# Altium schematic sheet Diode - Zener.SchDoc
size A3; SheetNumber: 20; SheetTotal: 20
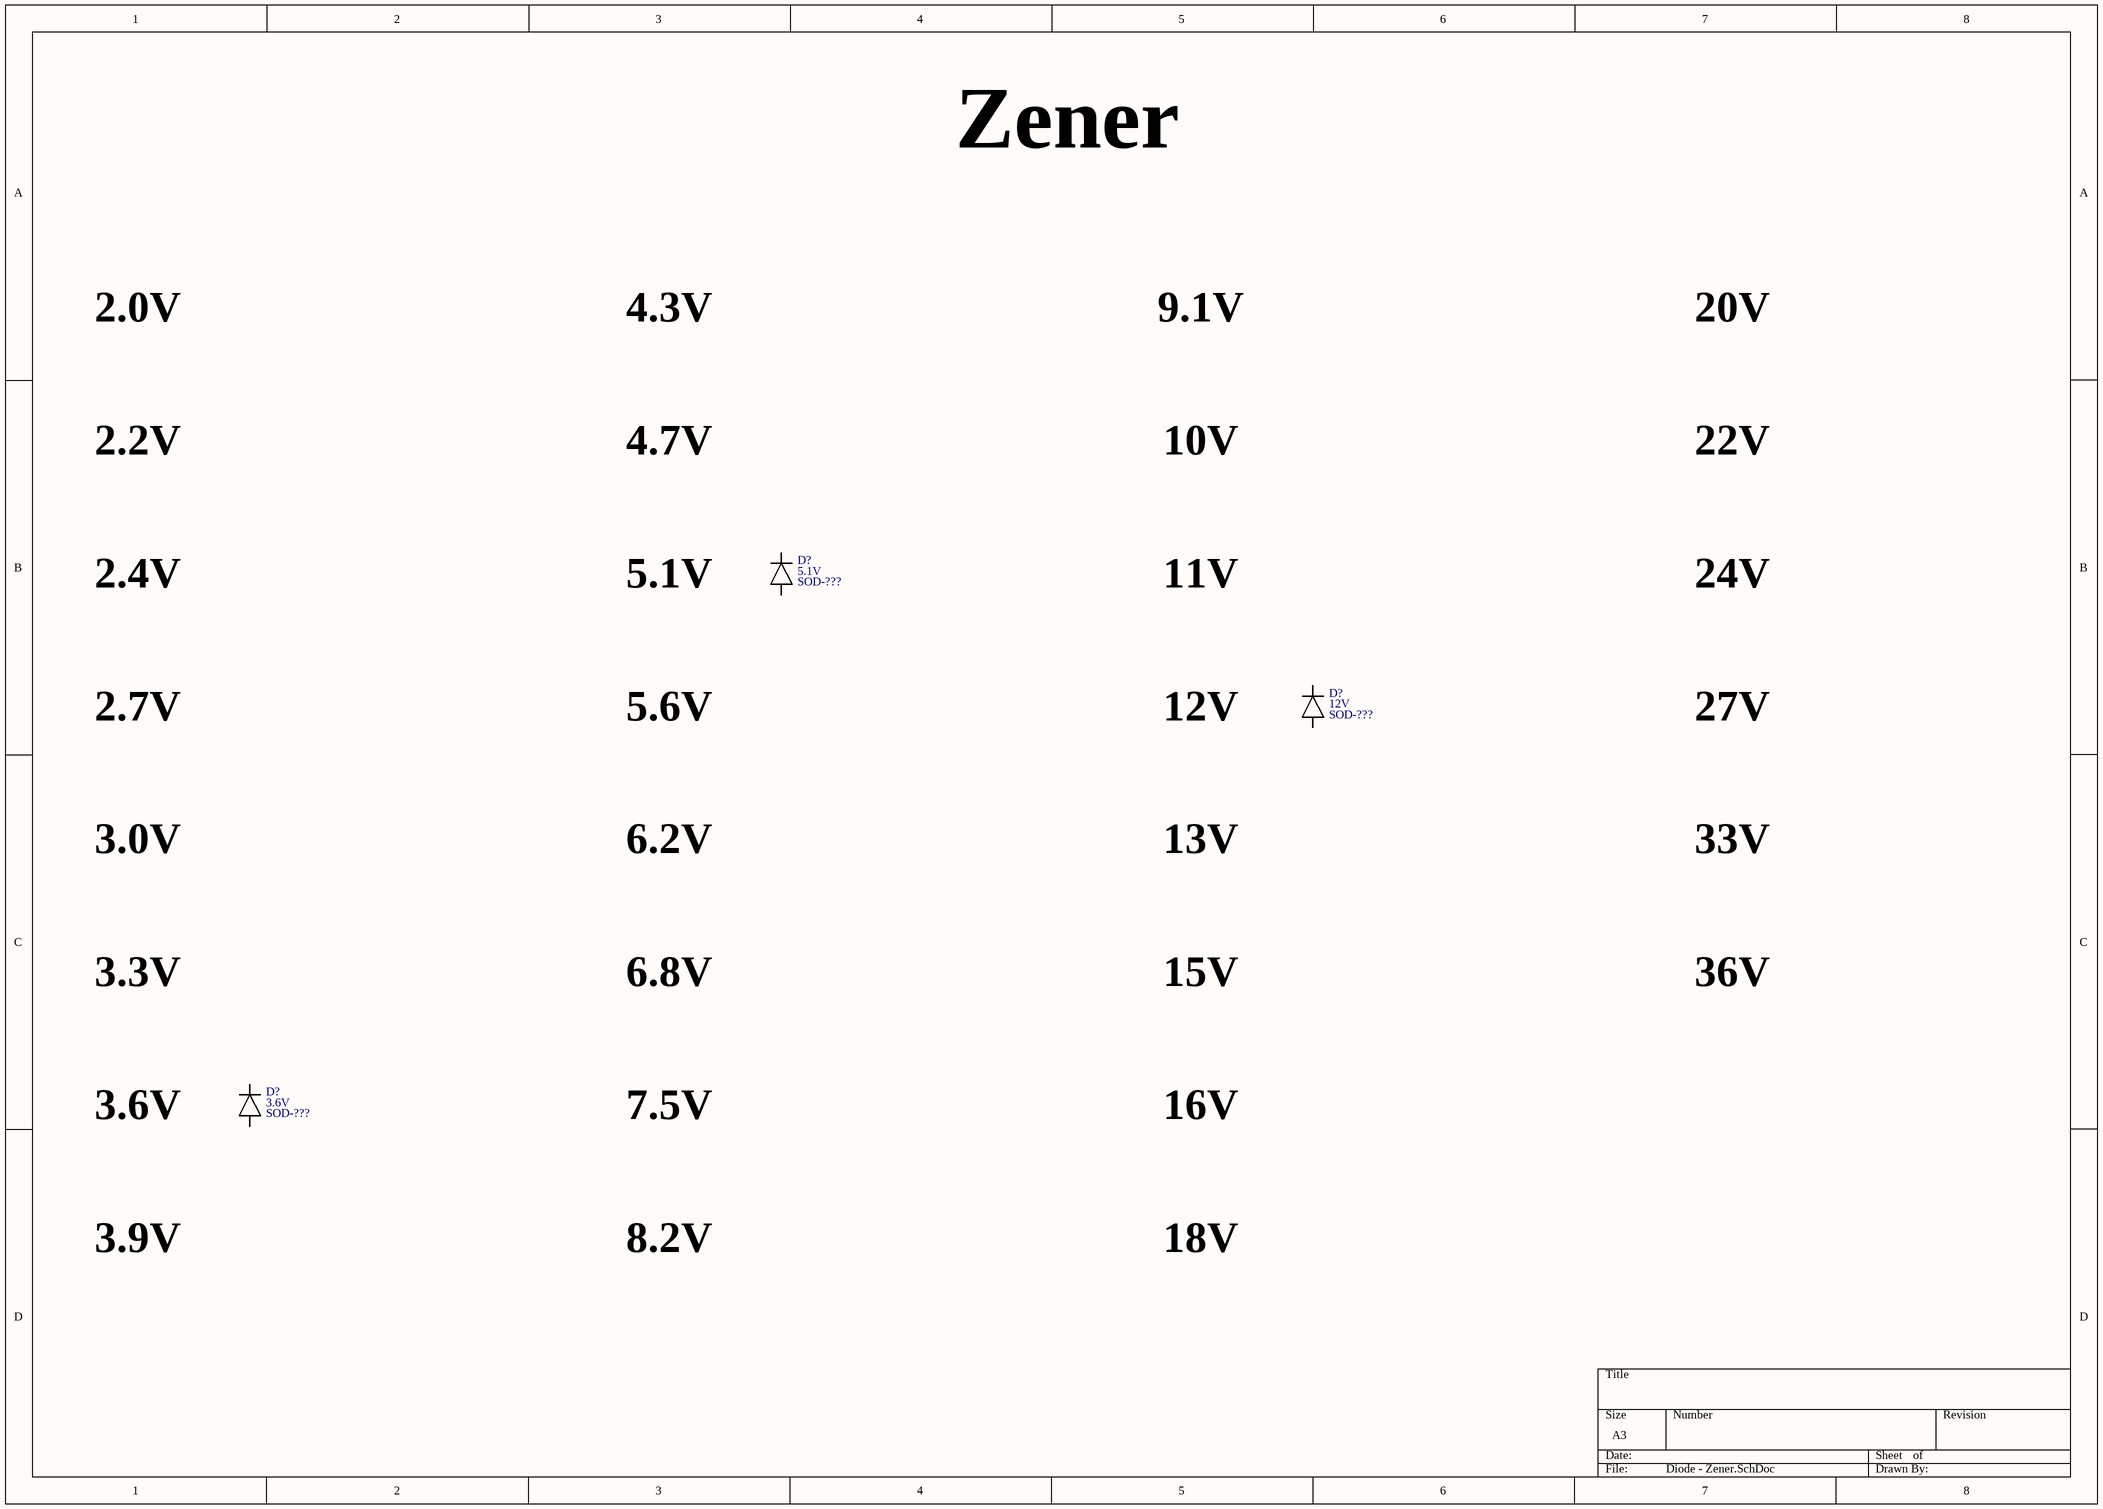
[diagram p0: Diode - Zener.SchDoc]

## Notes on the sheet
- Zener
- 2.0V
- 4.3V
- 9.1V
- 20V
- 2.2V
- 4.7V
- 10V
- 22V
- D?
- 5.1V
- SOD-???
- 2.4V
- 11V
- 24V
- 12V
- 2.7V
- 5.6V
- 27V
- 3.0V
- 6.2V
- 13V
- 33V
- 3.3V
- 6.8V
- 15V
- 36V
- 3.6V
- 7.5V
- 16V
- 3.9V
- 8.2V
- 18V